# Altium schematic sheet Jumper Matrix.SchDoc: Jumper Matrix
size Letter; SheetNumber: 19
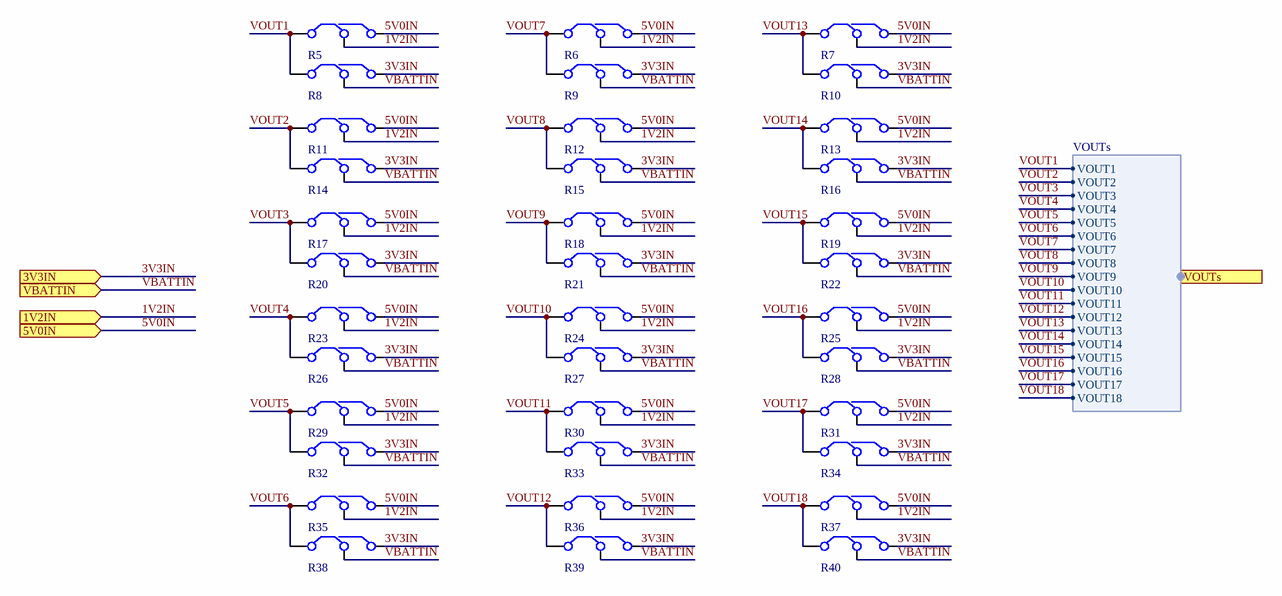
[diagram p0: Jumper Matrix.SchDoc]

## Parts
R5  Jumper  [SKP-RMCF1210orRMCF2010]  (value not drawn)
R6  Jumper  [SKP-RMCF1210orRMCF2010]  (value not drawn)
R7  Jumper  [SKP-RMCF1210orRMCF2010]  (value not drawn)
R8  Jumper  [SKP-RMCF1210orRMCF2010]  (value not drawn)
R9  Jumper  [SKP-RMCF1210orRMCF2010]  (value not drawn)
R10  Jumper  [SKP-RMCF1210orRMCF2010]  (value not drawn)
R11  Jumper  [SKP-RMCF1210orRMCF2010]  (value not drawn)
R12  Jumper  [SKP-RMCF1210orRMCF2010]  (value not drawn)
R13  Jumper  [SKP-RMCF1210orRMCF2010]  (value not drawn)
R14  Jumper  [SKP-RMCF1210orRMCF2010]  (value not drawn)
R15  Jumper  [SKP-RMCF1210orRMCF2010]  (value not drawn)
R16  Jumper  [SKP-RMCF1210orRMCF2010]  (value not drawn)
R17  Jumper  [SKP-RMCF1210orRMCF2010]  (value not drawn)
R18  Jumper  [SKP-RMCF1210orRMCF2010]  (value not drawn)
R19  Jumper  [SKP-RMCF1210orRMCF2010]  (value not drawn)
R20  Jumper  [SKP-RMCF1210orRMCF2010]  (value not drawn)
R21  Jumper  [SKP-RMCF1210orRMCF2010]  (value not drawn)
R22  Jumper  [SKP-RMCF1210orRMCF2010]  (value not drawn)
R23  Jumper  [SKP-RMCF1210orRMCF2010]  (value not drawn)
R24  Jumper  [SKP-RMCF1210orRMCF2010]  (value not drawn)
R25  Jumper  [SKP-RMCF1210orRMCF2010]  (value not drawn)
R26  Jumper  [SKP-RMCF1210orRMCF2010]  (value not drawn)
R27  Jumper  [SKP-RMCF1210orRMCF2010]  (value not drawn)
R28  Jumper  [SKP-RMCF1210orRMCF2010]  (value not drawn)
R29  Jumper  [SKP-RMCF1210orRMCF2010]  (value not drawn)
R30  Jumper  [SKP-RMCF1210orRMCF2010]  (value not drawn)
R31  Jumper  [SKP-RMCF1210orRMCF2010]  (value not drawn)
R32  Jumper  [SKP-RMCF1210orRMCF2010]  (value not drawn)
R33  Jumper  [SKP-RMCF1210orRMCF2010]  (value not drawn)
R34  Jumper  [SKP-RMCF1210orRMCF2010]  (value not drawn)
R35  Jumper  [SKP-RMCF1210orRMCF2010]  (value not drawn)
R36  Jumper  [SKP-RMCF1210orRMCF2010]  (value not drawn)
R37  Jumper  [SKP-RMCF1210orRMCF2010]  (value not drawn)
R38  Jumper  [SKP-RMCF1210orRMCF2010]  (value not drawn)
R39  Jumper  [SKP-RMCF1210orRMCF2010]  (value not drawn)
R40  Jumper  [SKP-RMCF1210orRMCF2010]  (value not drawn)

## Ports
1V2IN (in), 3V3IN (in), 5V0IN (in), VBATTIN (in), VOUTs (harness VOUTs)

## Harnesses
VOUTs: VOUT1, VOUT2, VOUT3, VOUT4, VOUT5, VOUT6, VOUT7, VOUT8, VOUT9, VOUT10, VOUT11, VOUT12, VOUT13, VOUT14, VOUT15, VOUT16, VOUT17, VOUT18

## Nets
1V2IN: R5.2 R6.2 R7.2 R11.2 R12.2 R13.2 R17.2 R18.2 R19.2 R23.2 R24.2 R25.2 R29.2 R30.2 R31.2 R35.2 R36.2 R37.2 ; port 1V2IN
3V3IN: R8.3 R9.3 R10.3 R14.3 R15.3 R16.3 R20.3 R21.3 R22.3 R26.3 R27.3 R28.3 R32.3 R33.3 R34.3 R38.3 R39.3 R40.3 ; port 3V3IN
5V0IN: R5.3 R6.3 R7.3 R11.3 R12.3 R13.3 R17.3 R18.3 R19.3 R23.3 R24.3 R25.3 R29.3 R30.3 R31.3 R35.3 R36.3 R37.3 ; port 5V0IN
VBATTIN: R8.2 R9.2 R10.2 R14.2 R15.2 R16.2 R20.2 R21.2 R22.2 R26.2 R27.2 R28.2 R32.2 R33.2 R34.2 R38.2 R39.2 R40.2 ; port VBATTIN
VOUT1: R5.1 R8.1 ; port VOUTs.VOUT1
VOUT2: R11.1 R14.1 ; port VOUTs.VOUT2
VOUT3: R17.1 R20.1 ; port VOUTs.VOUT3
VOUT4: R23.1 R26.1 ; port VOUTs.VOUT4
VOUT5: R29.1 R32.1 ; port VOUTs.VOUT5
VOUT6: R35.1 R38.1 ; port VOUTs.VOUT6
VOUT7: R6.1 R9.1 ; port VOUTs.VOUT7
VOUT8: R12.1 R15.1 ; port VOUTs.VOUT8
VOUT9: R18.1 R21.1 ; port VOUTs.VOUT9
VOUT10: R24.1 R27.1 ; port VOUTs.VOUT10
VOUT11: R30.1 R33.1 ; port VOUTs.VOUT11
VOUT12: R36.1 R39.1 ; port VOUTs.VOUT12
VOUT13: R7.1 R10.1 ; port VOUTs.VOUT13
VOUT14: R13.1 R16.1 ; port VOUTs.VOUT14
VOUT15: R19.1 R22.1 ; port VOUTs.VOUT15
VOUT16: R25.1 R28.1 ; port VOUTs.VOUT16
VOUT17: R31.1 R34.1 ; port VOUTs.VOUT17
VOUT18: R37.1 R40.1 ; port VOUTs.VOUT18

## Notes on the sheet
- (the "License"); you may not use or redistribute this file except in compliance with the License. You
- This file and the information within it are licensed under the terms of the Apache License, Version 2.0
- Copyright
- Unless required by applicable law or agreed to in writing, content distributed under the License is
- distributed on an "AS IS" BASIS, WITHOUT WARRANTIES OR CONDITIONS OF ANY KIND,
- either express or implied. See the License for the specific language governing permissions and
- limitations under the License.
- may obtain a copy of the License at:
- http://www.apache.org/licenses/LICENSE-2.0
- Title
- Size:
- Date:
- Letter
- Number:
- Time:
- Revision:
- Sheet
- of
- University of Alberta
- Deptartment of Electrical
- and Computer Engineering
- Edmonton AB, Canada
- T6G 1H9
- File:

## Library data of the parts
R5-R40 = PowerRailSelector: Operating Temperature: -55°C ~ 155°C